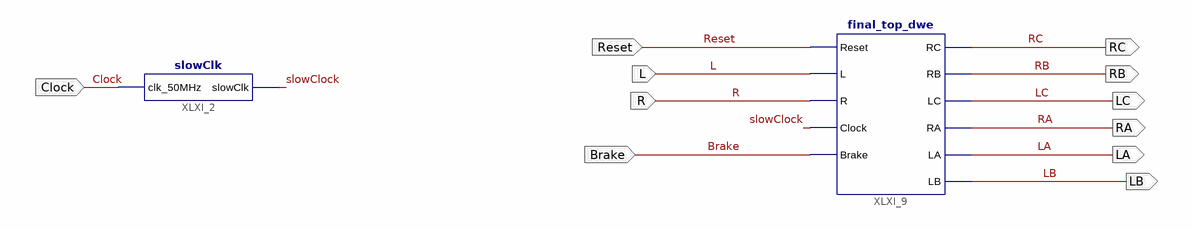
[diagram p0: schematic sheet 1]
// Xilinx ISE schematic top_dwe.sch (spartan3) as structural Verilog: 2 symbols, 11 ports
module top_dwe (
  input  Clock,
  input  Reset,
  input  L,
  input  R,
  input  Brake,
  output RC,
  output RB,
  output LC,
  output RA,
  output LA,
  output LB
);

  wire slowClock;

  slowClk XLXI_2 (.clk_50MHz(Clock), .slowClk(slowClock));
  final_top_dwe XLXI_9 (
    .Brake(Brake), .Clock(slowClock), .L(L), .LA(LA), .LB(LB), .LC(LC), .R(R), .RA(RA), .RB(RB), .RC(RC),
    .Reset(Reset));

  // Notes on the sheet:
  //   LOC on signal Clock = P8
  //   LOC on signal Reset = K4
  //   LOC on signal L = K3
  //   LOC on signal R = K2
  //   LOC on signal Brake = J4
  //   LOC on signal RC = J2
  //   LOC on signal RB = J1
  //   LOC on signal LC = M10
  //   LOC on signal RA = H1
  //   LOC on signal LA = F15
  //   LOC on signal LB = P12
endmodule
